# EAGLE design Bike_Speedo (EAGLE 9.6.2)
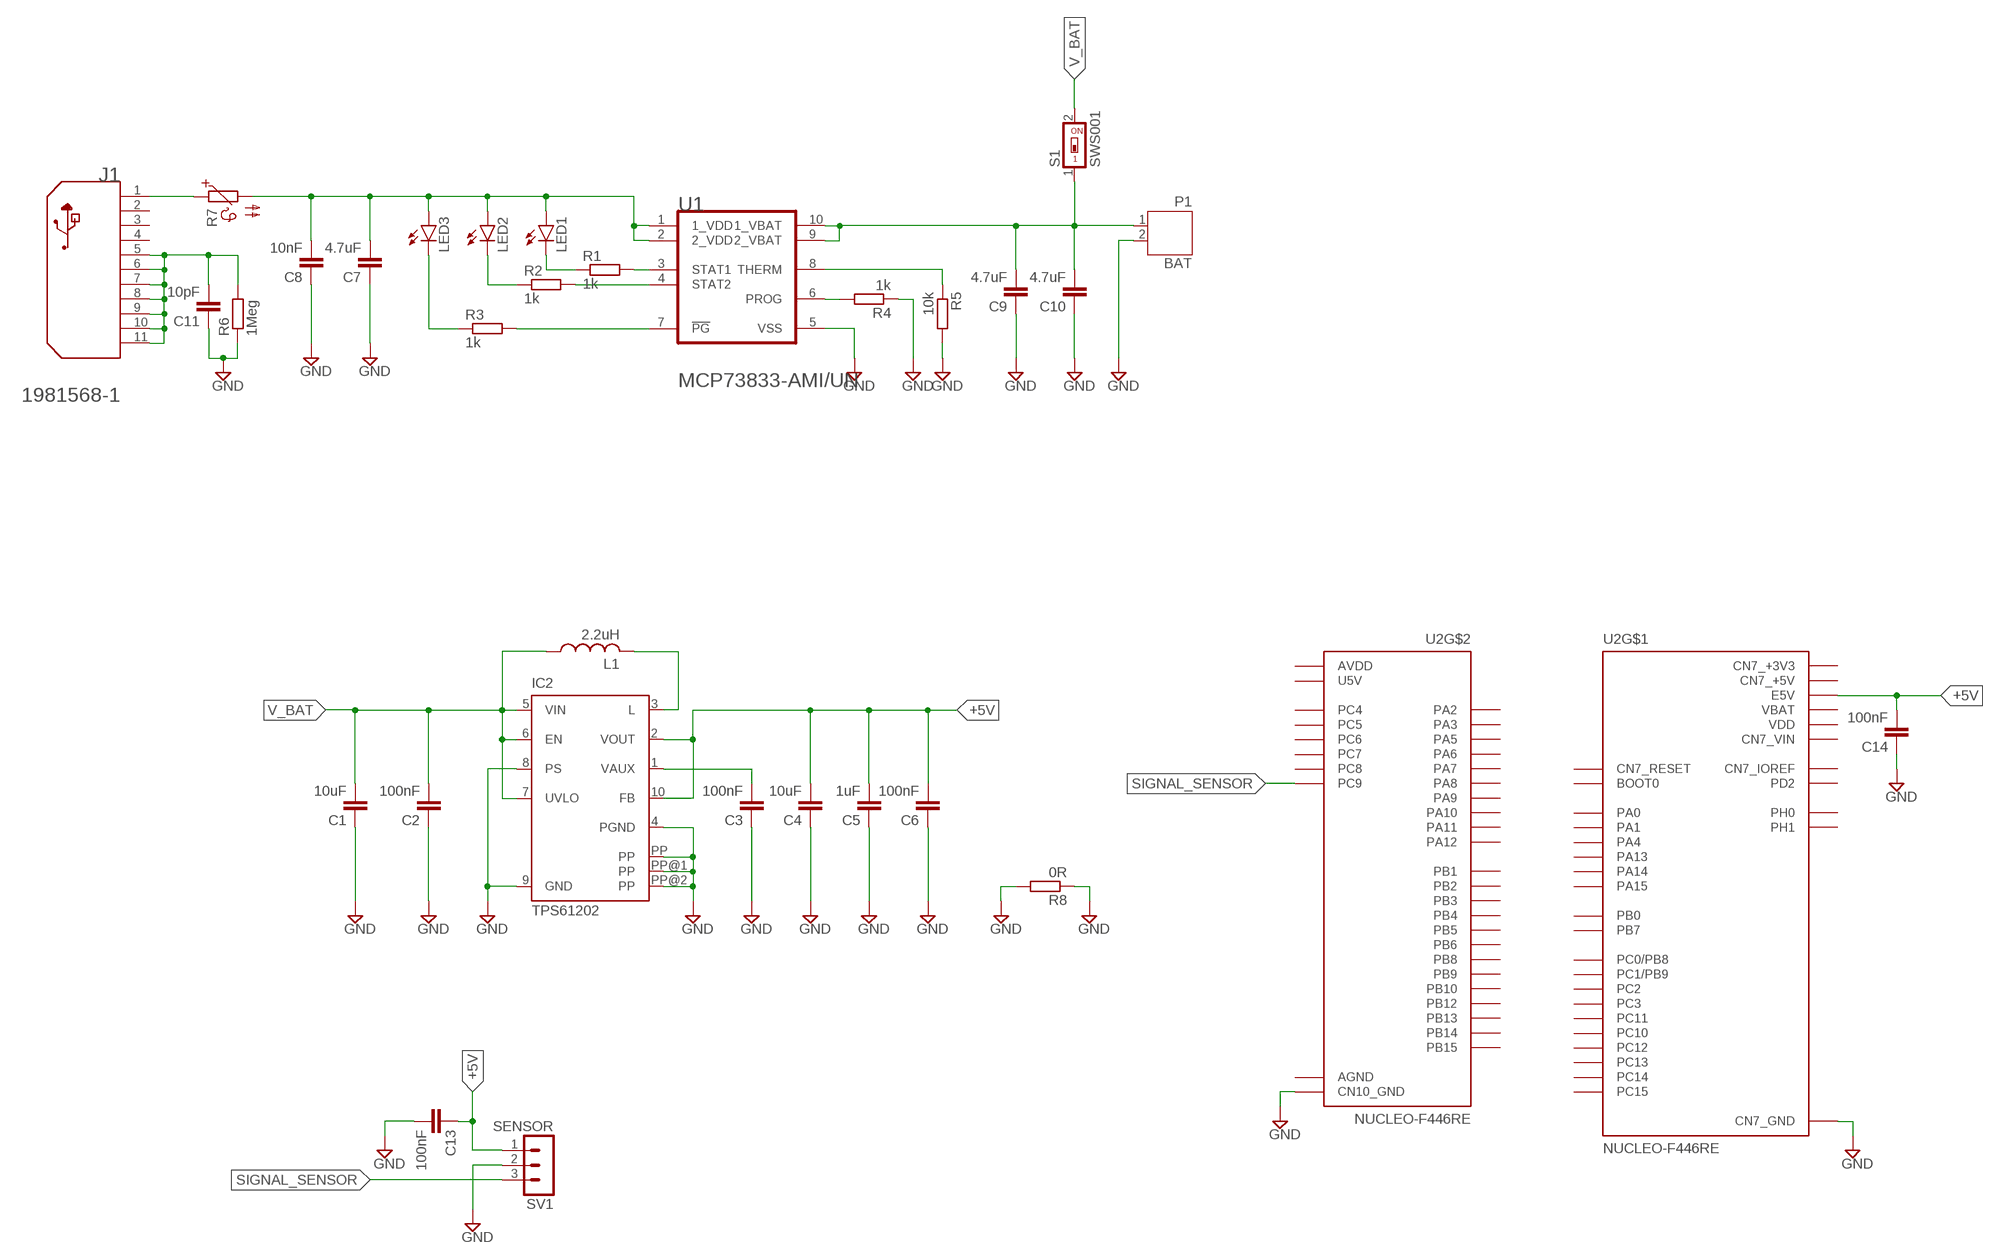
[diagram p0: schematic, sheet 1]

## Parts
C1  10uF  C-EUC0805  [C0805]
C2  100nF  C-EUC0805  [C0805]
C3  100nF  C-EUC0805  [C0805]
C4  10uF  C-EUC0805  [C0805]
C5  1uF  C-EUC0805  [C0805]
C6  100nF  C-EUC0805  [C0805]
C7  4.7uF  C-EUC0805  [C0805]
C8  10nF  C-EUC0805  [C0805]
C9  4.7uF  C-EUC0805  [C0805]
C10  4.7uF  C-EUC0805  [C0805]
C11  10pF  C-EUC0805  [C0805]
C13  100nF  C-EUC0805  [C0805]
C14  100nF  C-EUC0805  [C0805]
IC2  TPS61202  [S-PDSO-N10]
J1  TE_CONNECTIVITY_1981568-1TE_CONNECTIVITY_1981568-1_0_0  [TE_CONNECTIVITY_1981568-1_0]
L1  2.2uH  L-USL3216C  [L3216C]
LED1  LEDSML0805  [SML0805]
LED2  LEDSML0805  [SML0805]
LED3  LEDSML0805  [SML0805]
P1  BAT  JST-PH2  [JST-PH2]
R1  1k  R-EU_R0805  [R0805]
R2  1k  R-EU_R0805  [R0805]
R3  1k  R-EU_R0805  [R0805]
R4  1k  R-EU_R0805  [R0805]
R5  10k  R-EU_R0805  [R0805]
R6  1Meg  R-EU_R0805  [R0805]
R7  PTC660  [P660]
R8  0R  R-EU_R0805  [R0805]
S1  SWS001  [SMS-001]
SV1  SENSOR  MA03-1  [MA03-1]
U1  MICROCHIP_MCP73833-AMI-UNMICROCHIP_MCP73833-AMI-UN_0_0  [MICROCHIP_MCP73833-AMI-UN_0]
U2  NUCLEO-F446RE  [MODULE_NUCLEO-F446RE]

## Nets
+5V: C4.2 C5.2 C6.2 C13.1 C14.2 IC2.2(VOUT) IC2.10(FB) SV1.1 U2.CN7_6(E5V)
GND: C1.1 C2.1 C3.1 C4.1 C5.1 C6.1 C7.1 C8.1 C9.1 C10.1 C11.1 C13.2 C14.1 IC2.4(PGND) IC2.8(PS) IC2.9(GND) IC2.PP IC2.PP@1(PP) IC2.PP@2(PP) P1.2 R4.1 R5.2 R6.1 R8.1 R8.2 SV1.2 U1.5(VSS) U2.CN7_8(CN7_GND) U2.CN7_19(CN7_GND) U2.CN7_20(CN7_GND) U2.CN7_22(CN7_GND) U2.CN10_9(CN10_GND) U2.CN10_20(CN10_GND)
N$1: J1.1(VBUS) R7.1
N$2: IC2.3(L) L1.2
N$3: C3.2 IC2.1(VAUX)
N$4: C7.2 C8.2 LED1.A LED2.A LED3.A R7.2 U1.1(1_VDD) U1.2(2_VDD)
N$5: C11.2 J1.5(GND) J1.6(SHLD1) J1.7(SHLD2) J1.8(SHLD3) J1.9(SHLD4) J1.10(SHLD5) J1.11(SHLD6) R6.2
N$6: LED1.C R1.1
N$7: LED2.C R2.1
N$8: LED3.C R3.1
N$9: R3.2 U1.7(!PG!)
N$10: R2.2 U1.4(STAT2)
N$11: R1.2 U1.3(STAT1)
N$12: R4.2 U1.6(PROG)
N$14: R5.1 U1.8(THERM)
N$15: C9.2 C10.2 P1.1 S1.1 U1.9(2_VBAT) U1.10(1_VBAT)
SIGNAL_SENSOR: SV1.3 U2.CN10_1(PC9)
V_BAT: C1.2 C2.2 IC2.5(VIN) IC2.6(EN) IC2.7(UVLO) L1.1 S1.2
Unconnected: J1.2(D-) J1.3(D+) J1.4(ID) U2.CN5_1(D8) U2.CN5_2(D9) U2.CN5_3(D10) U2.CN5_4(D11) U2.CN5_5(D12) U2.CN5_6(D13) U2.CN5_9(D14) U2.CN5_10(D15) U2.CN6_2(CN6_IOREF) U2.CN6_3(CN6_RESET) U2.CN7_1(PC10) U2.CN7_2(PC11) U2.CN7_3(PC12) U2.CN7_4(PD2) U2.CN7_7(BOOT0) U2.CN7_12(CN7_IOREF) U2.CN7_13(PA13) U2.CN7_14(CN7_RESET) U2.CN7_15(PA14) U2.CN7_17(PA15) U2.CN7_21(PB7) U2.CN7_23(PC13) U2.CN7_25(PC14) U2.CN7_27(PC15) U2.CN7_28(PA0) U2.CN7_29(PH0) U2.CN7_30(PA1) U2.CN7_31(PH1) U2.CN7_32(PA4) U2.CN7_34(PB0) U2.CN7_35(PC2) U2.CN7_36(PC1/PB9) U2.CN7_37(PC3) U2.CN7_38(PC0/PB8) U2.CN8_1(A0) U2.CN8_2(A1) U2.CN8_3(A2) U2.CN8_4(A3) U2.CN8_5(A4) U2.CN8_6(A5) U2.CN9_1(D0) U2.CN9_2(D1) U2.CN9_3(D2) U2.CN9_4(D3) U2.CN9_5(D4) U2.CN9_6(D5) U2.CN9_7(D6) U2.CN9_8(D7) U2.CN10_2(PC8) U2.CN10_3(PB8) U2.CN10_4(PC6) U2.CN10_5(PB9) U2.CN10_6(PC5) U2.CN10_11(PA5) U2.CN10_12(PA12) U2.CN10_13(PA6) U2.CN10_14(PA11) U2.CN10_15(PA7) U2.CN10_16(PB12) U2.CN10_17(PB6) U2.CN10_19(PC7) U2.CN10_21(PA9) U2.CN10_22(PB2) U2.CN10_23(PA8) U2.CN10_24(PB1) U2.CN10_25(PB10) U2.CN10_26(PB15) U2.CN10_27(PB4) U2.CN10_28(PB14) U2.CN10_29(PB5) U2.CN10_30(PB13) U2.CN10_31(PB3) U2.CN10_33(PA10) U2.CN10_34(PC4) U2.CN10_35(PA2) U2.CN10_37(PA3)

## Power pins joined to a net without a drawn wire
AGND: U2.CN10_32(AGND)
AREF: U2.CN5_8(AREF)
AVDD: U2.CN10_7(AVDD)
CN5_GND: U2.CN5_7(CN5_GND)
CN6_+3V3: U2.CN6_4(CN6_+3V3)
CN6_+5V: U2.CN6_5(CN6_+5V)
CN6_GND: U2.CN6_6(CN6_GND) U2.CN6_7(CN6_GND)
CN6_VIN: U2.CN6_8(CN6_VIN)
CN7_+3V3: U2.CN7_16(CN7_+3V3)
CN7_+5V: U2.CN7_18(CN7_+5V)
CN7_VIN: U2.CN7_24(CN7_VIN)
U5V: U2.CN10_8(U5V)
VBAT: U2.CN7_33(VBAT)
VDD: U2.CN7_5(VDD)

## Library data of the parts
C1-C11 C13 C14 = rcl:C-EU: CAPACITOR, European symbol; SPICEPREFIX: C
IC2 = texas:TPS6120*: LOW INPUT VOLTAGE SYNCHRONOUS BOOST CONVERTER WITH 1.3-A SWITCHES Source: http://focus.ti.com/lit/ds/symlink/tps61200.pdf; MPN: TPS61202DRCR; OC_FARNELL: unknown; OC_NEWARK: 37M0069
J1 = TE Connectivity - 1981568-1:TE_CONNECTIVITY_1981568-1: USB-5-6SHLD; BODY_ORIENTATION: RightAngle; CIIVA_IDS: 777681; CONTACT_MATERIAL: CopperAlloy; CONTACT_PLATING: GoldOverNickel; CURRENT_RATING_MAX: 1/ContactA; DATASHEET_URL: http://www.mouser.com/ds/2/418/NG_CD_1981568_E2-621296.pdf; DATASHEET_VERSION: Rev. E2, 08/2015; FOOTPRINT_VARIANT_NAME_0: Manufacturer Recommended; GENDER: RCP; HOUSING_MATERIAL: Thermoplastic; IMPORTED: yes; IMPORTED_FROM: vault; IMPORT_TS: 1521844644; MANUFACTURER_URL: http://www.te.com/; MF: TE Connectivity; MOUNTING_STYLE: SurfaceMount; MPN: 1981568-1; NUMBER_OF_CONTACTS: 5POS; NUMBER_OF_PORTS: 1Port; NUMBER_OF_TERMINALS: 5; OPERATING_TEMPERATURE_MAX_DEG_C: 85C; OPERATING_TEMPERATURE_MIN_DEG_C: -55C; OPERATING_TEMP_RANGE: -55Cto85C; PACKAGING: TapeandReel; PITCH_MM: 0.65mm; PREFIX: J; PRODUCT_DEPTH_MM: 5.6mm; PRODUCT_HEIGHT_MM: 3mm; PRODUCT_LENGTH_MM: 8mm; RELEASE_DATE: 1501567754; TERMINATION_METHOD: Solder; TYPE: MicroUSB; VAULT_GUID: 52E20B74-CE8E-4E26-B456-4302D9606DDA; VAULT_REVISION: 93EDE502-4307-4D15-9B25-150CD06771CA; VOLTAGE_RATING_MAX: 30VAC
L1 = rcl:L-US: INDUCTOR, American symbol; SPICEPREFIX: L
LED1-LED3 = led:LED: LED OSRAM: - CHIPLED LG R971, LG N971, LY N971, LG Q971, LY Q971, LO R971, LY R971 LH N974, LH R974 LS Q976, LO Q976, LY Q976 LO Q996 - Hyper CHIPLED LW Q18S LB Q993, LB Q99A, LB R99A - SideLED LS A670, LO A670, LY A670, LG A670, LP A670 LB A673, LV A673, LT A673, LW A673 LH A674 LY A675 LS A676, LA A676, LO A676, LY A676, LW A676 LS A679, LY A679, LG A679 - Hyper Micro SIDELED® LS Y876, LA Y876, LO Y876, LY Y876 LT Y87S - SmartLED LW L88C, LW L88S LB L89C, LB L89S, LG L890 LS L89K, LO L89K, LY L89K LS L896, LA L896, LO L896, LY L896 - TOPLED LS T670, LO T670, LY T670, LG T670, LP T670 LSG T670, LSP T670, LSY T670, LOP T670, LYG T670 LG T671, LOG T671, LSG T671 LB T673, LV T673, LT T673, LW T673 LH T674 LS T676, LA T676, LO T676, LY T676, LB T676, LH T676, LSB T676, LW T676 LB T67C, LV T67C, LT T67C, LS T67K, LO T67K, LY T67K, LW E67C LS E67B, LA E67B, LO E67B, LY E67B, LB E67C, LV E67C, LT E67C LW T67C LS T679, LY T679, LG T679 LS T770, LO T770, LY T770, LG T770, LP T770 LB T773, LV T773, LT T773, LW T773 LH T774 LS E675, LA E675, LY E675, LS T675 LS T776, LA T776, LO T776, LY T776, LB T776 LHGB T686 LT T68C, LB T68C - Hyper Mini TOPLED® LB M676 - Mini TOPLED Santana® LG M470 LS M47K, LO M47K, LY M47K Source: http://www.osram.convergy.de LUXEON: - LUMILED® LXK2-PW12-R00, LXK2-PW12-S00, LXK2-PW14-U00, LXK2-PW14-V00 LXK2-PM12-R00, LXK2-PM12-S00, LXK2-PM14-U00 LXK2-PE12-Q00, LXK2-PE12-R00, LXK2-PE12-S00, LXK2-PE14-T00, LXK2-PE14-U00 LXK2-PB12-K00, LXK2-PB12-L00, LXK2-PB12-M00, LXK2-PB14-N00, LXK2-PB14-P00, LXK2-PB14-Q00 LXK2-PR12-L00, LXK2-PR12-M00, LXK2-PR14-Q00, LXK2-PR14-R00 LXK2-PD12-Q00, LXK2-PD12-R00, LXK2-PD12-S00 LXK2-PH12-R00, LXK2-PH12-S00 LXK2-PL12-P00, LXK2-PL12-Q00, LXK2-PL12-R00 Source: www.luxeon.com KINGBRIGHT: KA-3528ASYC Source: www.kingbright.com
P1 = jst-ph:JST-PH2
R1-R6 R8 = rcl:R-EU_: RESISTOR, European symbol; SPICEPREFIX: R
R7 = ptc-ntc:PTC660: PHILIPS PTC; OC_FARNELL: unknown; OC_NEWARK: unknown
S1 = smd-special:SWS001: SMD Dip Switch 1 pol.
SV1 = con-lstb:MA03-1: PIN HEADER; OC_FARNELL: unknown; OC_NEWARK: unknown
U1 = UN:MICROCHIP_MCP73833-AMI-UN: PM-BM-MCP73833-IL10; CIIVA_IDS: 961401; DATASHEET_VERSION: revB, May-2009; FOOTPRINT_VARIANT_NAME_0: Level C; FOOTPRINT_VARIANT_NAME_1: Level B; FOOTPRINT_VARIANT_NAME_2: Level A; IMPORTED: yes; IMPORTED_FROM: vault; IMPORT_TS: 1521843586; MF: Microchip; MPN: MCP73833-AMI/UN; PACKAGE: MSOP-UN10; PACKAGE_DESCRIPTION: 10-Lead Plastic Micro Small Outline Package (UN) [MSOP]; PACKAGE_VERSION: revBB, Aug-2009; PREFIX: U; RELEASE_DATE: 1300334258; VAULT_GUID: C4FD6C4C-3805-4DDA-8510-135B1EEBE1CB; VAULT_REVISION: 8E8D7015-F88C-4C11-A01A-0CDF8DEB0470
U2 = NUCLEO-F446RE:NUCLEO-F446RE: STM32 Nucleo-64 development board with STM32F446RET6 MCU, supports Arduino and ST morpho connectivity Check prices <https://pricing.snapeda.com/parts/NUCLEO-F446RE/STMicroelectronics/view-part?ref=eda>; AVAILABILITY: Good; DESCRIPTION: STM32F446RE, mbed-Enabled Development Nucleo-64 STM32F4 ARM® Cortex®-M4 MCU 32-Bit Embedded Evaluation Board; MF: STMicroelectronics; MP: NUCLEO-F446RE; PACKAGE: None; PRICE: None; PURCHASE-URL: https://pricing.snapeda.com/search/part/NUCLEO-F446RE/?ref=eda

## Board
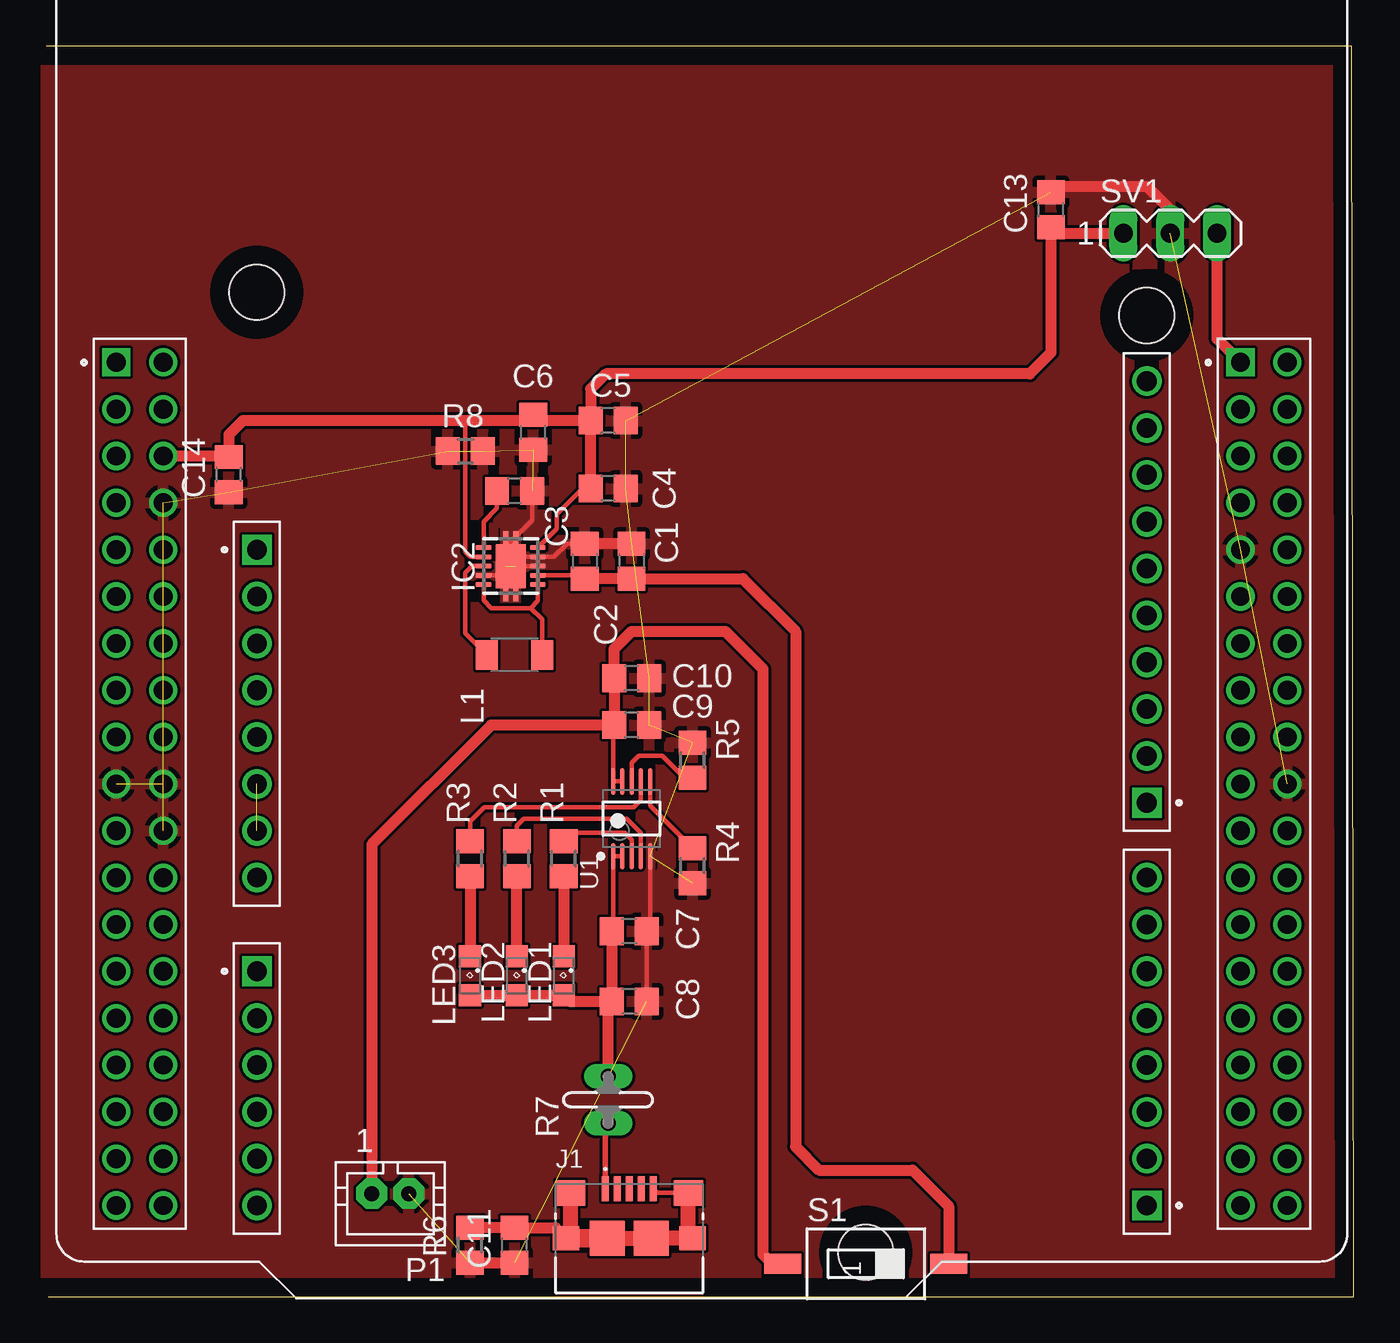
[diagram p1: board, top side]

Size 70.92 x 67.81 mm. Coordinates in mm from the lower left corner, seen from the top.
Outline: 0.13,0 70.92,0 70.79,67.81 0,67.81
Copper layers (1*16): Top 0.035mm / dielectric 1.5mm / Bottom 0.035mm
Design rules "default *": minimum track width 6mil, minimum drill 0.35mm, track to track 6mil, track to pad 6mil, pad to pad 6mil, via to via 6mil, smd to smd 6mil, copper to edge 40mil, drill to drill 6mil, minimum pad ring 10mil, minimum via ring 8mil, stop-mask expansion 4mil, vias tented up to drill 0mil, thermal gap 10mil

### Footprints (pad centres in the part's own frame; a part is rotated, then mirrored left to right if it is on the bottom)
C0805 = smd 1.3 x 1.5: 1 -0.95,0; 2 0.95,0
S-PDSO-N10 = smd 0.28 x 0.85: 1 -1,-1.475; 2 -0.5,-1.475; 3 0,-1.475; 4 0.5,-1.475; 5 1,-1.475; 6 1,1.475; 7 0.5,1.475; 8 0,1.475; 9 -0.5,1.475; 10 -1,1.475 | smd 2.4 x 1.65: PP 0,0 | smd 3.8 x 0.28: PP@1 0,0.275; PP@2 0,-0.275
TE_CONNECTIVITY_1981568-1_0 = smd 0.4 x 1.35: 1 -1.3,0; 2 -0.65,0; 3 0,0; 4 0.65,0; 5 1.3,0 | smd 1.6 x 1.4: 6 -3.2,-0.225; 7 3.2,-0.225 | smd 1.45 x 1.3: 8 -3.425,-2.675; 9 3.425,-2.675 | smd 1.9 x 1.9: 10 -1.2,-2.675; 11 1.2,-2.675
L3216C = smd 1.2 x 1.6: 1 -1.5,0; 2 1.5,0
SML0805 = smd 1.2 x 1.2: A 1.05,0; C -1.05,0
JST-PH2 = drill 0.813 pad 1.676 octagon: 1 1,0; 2 -1,0
R0805 = smd 1.3 x 1.5: 1 -0.95,0; 2 0.95,0
P660 = drill 0.813 long: 1 -1.27,0; 2 1.27,0
SMS-001 = smd 1.092 x 2.007: 1 0,-4.496; 2 0,4.496
MA03-1 = drill 1.016 long: 1 -2.54,0; 2 0,0; 3 2.54,0
MICROCHIP_MCP73833-AMI-UN_0 = smd 1.45 x 0.25: 1 -2.025,1; 2 -2.025,0.5; 3 -2.025,0; 4 -2.025,-0.5; 5 -2.025,-1; 6 2.025,-1; 7 2.025,-0.5; 8 2.025,0; 9 2.025,0.5; 10 2.025,1
MODULE_NUCLEO-F446RE = drill 1.07 square: CN5_1 24.13,-14.37; CN6_1 -24.13,-0.65; CN8_1 -24.13,-23.51; CN9_1 24.13,-36.21 | drill 1.07: CN5_2 24.13,-11.83; CN5_3 24.13,-9.29; CN5_4 24.13,-6.75; CN5_5 24.13,-4.21; CN5_6 24.13,-1.67; CN5_7 24.13,0.87; CN5_8 24.13,3.41; CN5_9 24.13,5.95; CN5_10 24.13,8.49; CN6_2 -24.13,-3.19; CN6_3 -24.13,-5.73; CN6_4 -24.13,-8.27; CN6_5 -24.13,-10.81; CN6_6 -24.13,-13.35; CN6_7 -24.13,-15.89; CN6_8 -24.13,-18.43; CN8_2 -24.13,-26.05; CN8_3 -24.13,-28.59; CN8_4 -24.13,-31.13; CN8_5 -24.13,-33.67; CN8_6 -24.13,-36.21; CN9_2 24.13,-33.67; CN9_3 24.13,-31.13; CN9_4 24.13,-28.59; CN9_5 24.13,-26.05; CN9_6 24.13,-23.51; CN9_7 24.13,-20.97; CN9_8 24.13,-18.43 | drill 1.02 square: CN7_1 -31.75,9.51; CN10_1 29.21,9.51 | drill 1.02: CN7_2 -29.21,9.51; CN7_3 -31.75,6.97; CN7_4 -29.21,6.97; CN7_5 -31.75,4.43; CN7_6 -29.21,4.43; CN7_7 -31.75,1.89; CN7_8 -29.21,1.89; CN7_9 -31.75,-0.65; CN7_10 -29.21,-0.65; CN7_11 -31.75,-3.19; CN7_12 -29.21,-3.19; CN7_13 -31.75,-5.73; CN7_14 -29.21,-5.73; CN7_15 -31.75,-8.27; CN7_16 -29.21,-8.27; CN7_17 -31.75,-10.81; CN7_18 -29.21,-10.81; CN7_19 -31.75,-13.35; CN7_20 -29.21,-13.35; CN7_21 -31.75,-15.89; CN7_22 -29.21,-15.89; CN7_23 -31.75,-18.43; CN7_24 -29.21,-18.43; CN7_25 -31.75,-20.97; CN7_26 -29.21,-20.97; CN7_27 -31.75,-23.51; CN7_28 -29.21,-23.51; CN7_29 -31.75,-26.05; CN7_30 -29.21,-26.05; CN7_31 -31.75,-28.59; CN7_32 -29.21,-28.59; CN7_33 -31.75,-31.13; CN7_34 -29.21,-31.13; CN7_35 -31.75,-33.67; CN7_36 -29.21,-33.67; CN7_37 -31.75,-36.21; CN7_38 -29.21,-36.21; CN10_2 31.75,9.51; CN10_3 29.21,6.97; CN10_4 31.75,6.97; CN10_5 29.21,4.43; CN10_6 31.75,4.43; CN10_7 29.21,1.89; CN10_8 31.75,1.89; CN10_9 29.21,-0.65; CN10_10 31.75,-0.65; CN10_11 29.21,-3.19; CN10_12 31.75,-3.19; CN10_13 29.21,-5.73; CN10_14 31.75,-5.73; CN10_15 29.21,-8.27; CN10_16 31.75,-8.27; CN10_17 29.21,-10.81; CN10_18 31.75,-10.81; CN10_19 29.21,-13.35; CN10_20 31.75,-13.35; CN10_21 29.21,-15.89; CN10_22 31.75,-15.89; CN10_23 29.21,-18.43; CN10_24 31.75,-18.43; CN10_25 29.21,-20.97; CN10_26 31.75,-20.97; CN10_27 29.21,-23.51; CN10_28 31.75,-23.51; CN10_29 29.21,-26.05; CN10_30 31.75,-26.05; CN10_31 29.21,-28.59; CN10_32 31.75,-28.59; CN10_33 29.21,-31.13; CN10_34 31.75,-31.13; CN10_35 29.21,-33.67; CN10_36 31.75,-33.67; CN10_37 29.21,-36.21; CN10_38 31.75,-36.21 | hole 3: 8.89,-38.75; 24.13,12.05; -24.13,13.32

### Placement (x,y rotation side)
C1  31.75,39.88 270 top
C2  29.21,39.88 270 top
C3  25.4,43.69 180 top
C4  30.48,43.81 180 top
C5  30.48,47.5 180 top
C6  26.42,46.86 90 top
C7  31.62,19.81 180 top
C8  31.62,16 180 top
C9  31.75,30.99 180 top
C10  31.75,33.53 180 top
C11  25.4,2.79 90 top
C13  54.48,58.93 90 top
C14  9.91,44.58 90 top
IC2  25.19,39.61 270 top
J1  31.62,5.84 0 top
L1  25.4,34.8 180 top
LED1  28.07,17.4 270 top
LED2  25.53,17.4 270 top
LED3  22.99,17.4 270 top
P1  18.67,5.59 180 top
R1  28.07,23.75 90 top
R2  25.53,23.75 90 top
R3  22.99,23.75 90 top
R4  35.05,23.37 90 top
R5  35.05,29.08 90 top
R6  22.99,2.79 90 top
R7  30.48,10.67 90 top
R8  22.73,45.85 0 top
S1  44.45,1.78 270 top
SV1  60.96,57.66 0 top
U1  31.75,25.91 90 top
U2  35.56,41.15 0 top

### Tracks (layer width: path | path; a pad name or v marks a point on that pad's centre or on a via)
+5V
  Top 0.254: IC2.10 27.69,41.62 27.69,42.42 29.08,43.81 C4.2 | IC2.2 23.01,40.11 22.73,40.39 22.73,47.37 22.86,47.5
  Top 0.61: C4.2 C5.2 | U2.CN7_6 9.85,45.58 C14.2 9.91,46.74 10.67,47.5 22.86,47.5 25.4,47.5 26.1,47.5 | C5.2 26.67,47.5 26.1,47.5 | 26.1,47.5 25.97,47.5 | C5.2 29.53,49.22 30.35,50.04 53.34,50.04 54.48,51.18 C13.1 54.8,57.66 SV1.1 | C6.2 26.1,47.5
CN6_GND  (1 unrouted)
GND  (22 unrouted)
  Top 0.254: U1.5 32.75,19.99 C7.1 C8.1 | IC2.9 IC2.8 IC2.PP@1 25.97,40.11 IC2.9 | IC2.4 24.9,39.11 25.4,38.61 25.4,39.4 IC2.PP 25.19,40.94 26.35,42.1 C3.1 | IC2.9 27.53,40.11 28.25,40.83 C2.1
  Top 0.61: C1.1 C2.1 | R6.1 C11.1 | C13.2 54.8,60.2 59.69,60.2 60.96,58.93 SV1.2
  pour Top: 0,67.82 71.12,67.82 71.12,-2.03 0,-2.03
N$1
  Top 0.305: J1.1 30.32,9.24 R7.1
N$2
  Top 0.254: L1.2 22.73,35.97 22.73,39.24 23.11,39.62 23.7,39.62 IC2.3
N$3
  Top 0.254: IC2.1 23.72,42.01 24.45,42.74 C3.2
N$4
  Top 0.152: C7.2 30.67,19.56
  Top 0.254: C7.2 30.75,19.89 U1.1 U1.2
  Top 0.61: 30.67,19.56 C8.2 | 30.48,15.81 30.45,15.78 | C8.2 28.41,16 LED1.A LED2.A LED3.A | R7.2 30.48,15.81 | C8.2 30.48,15.81
N$5
  Top 0.254: 30.6,3.17 30.48,3.05 30.42,3.1 J1.10 | J1.7 33.15,5.62 J1.5
  Top 0.61: R6.2 C11.2 27.62,3.74 J1.8 | J1.9 34.82,3.39
  Top 0.813: J1.9 J1.11 J1.10 | 34.82,3.39 J1.7 | J1.6 28.42,3.39 J1.8
  Top 1.016: J1.8 J1.10
N$6
  Top 0.61: R1.1 LED1.C
N$7
  Top 0.61: LED2.C R2.1
N$8
  Top 0.61: R3.1 LED3.C
N$9
  Top 0.254: U1.7 32.25,26.92 31.88,26.54 23.75,26.54 22.99,25.78 R3.2
N$10
  Top 0.254: U1.4 32.25,25.15 31.5,25.91 25.91,25.91 25.53,25.53 R2.2
N$11
  Top 0.254: U1.3 31.75,24.77 31.37,25.15 28.51,25.15 R1.2
N$12
  Top 0.254: R4.2 32.75,26.62 U1.6
N$14
  Top 0.254: U1.8 31.75,28.96 32.13,29.34 33.4,29.34 34.6,28.13 R5.1
N$15
  Top 0.254: 30.75,30.94 U1.10 U1.9
  Top 0.61: C9.2 C10.2 30.8,35.12 31.75,36.07 36.83,36.07 38.86,34.04 38.86,2.29 39.37,1.78 S1.1 | C9.2 30.75,30.94 | C9.2 24.13,30.99 17.67,24.53 P1.1
SIGNAL_SENSOR
  Top 0.61: U2.CN10_1 63.5,51.93 SV1.3
V_BAT
  Top 0.254: 26.29,37.34 26.67,37.72 IC2.6 IC2.7 29.21,39.11 C2.2 | 26.29,37.34 24.13,37.34 23.72,37.75 IC2.5 | L1.1 26.9,36.73 26.29,37.34
  Top 0.61: 29.21,39.11 29.39,38.93 C1.2 37.78,38.93 40.64,36.07 40.64,8.13 41.91,6.86 46.99,6.86 48.95,4.9 S1.2